# Altium project PCB_Project.PrjPcb
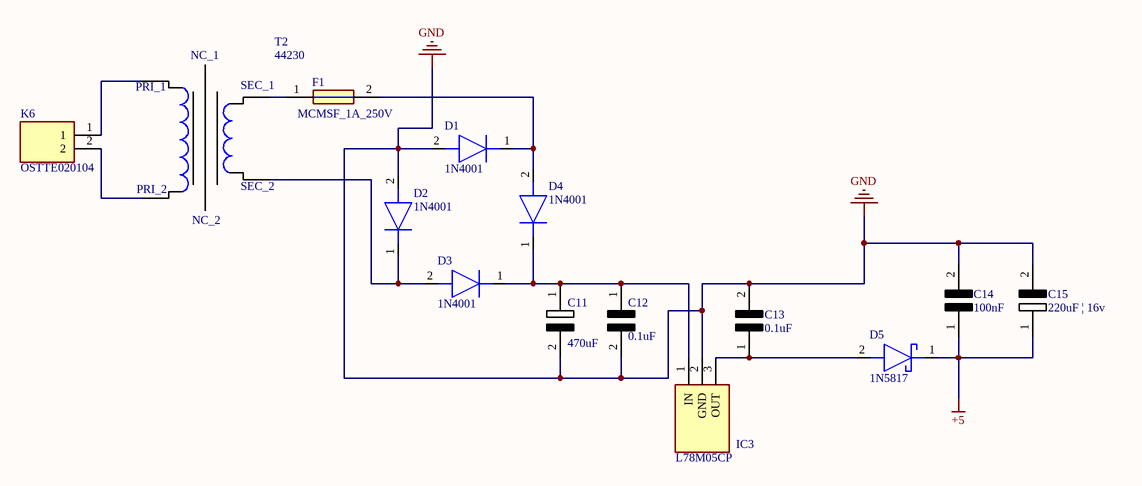
[diagram p0: Power_Unit.SchDoc]
4 sheets, 69 parts. Net scope: flat (ports and power ports of the same name join across sheets).
Board file: REDESIGN.PcbDoc
Sheets:
  Power_Unit.SchDoc
  Display_Unit.SchDoc
  Processing_Unit.SchDoc
  RTC_unit.SchDoc

## Sheet Power_Unit.SchDoc
size A4; SheetNumber: 1; SheetTotal: 4

### Parts
C11  470uF  [C0805]
C12  0.1uF  [C0805]
C13  0.1uF  [C0805]
C14  100nF  [C0805]
C15  220uF | 16v  [C0805]
D1  1N4001  [DIOAD1405W86L465D235]
D2  1N4001  [DIOAD1405W86L465D235]
D3  1N4001  [DIOAD1405W86L465D235]
D4  1N4001  [DIOAD1405W86L465D235]
D5  1N5817  [1n5817_footprint]
F1  MCMSF_1A_250V  [MCMSF1A250V]
IC3  L78M05CP  [TO255P460X1020X2030-3P]
K6  OSTTE020104  [OSTTE020104]
T2  44230  [44230]

### Nets
+5: C14.1 C15.1 D5.1(K)
GND: C11.2 C12.2 C13.2 C14.2 C15.2 D1.2(A) D2.2(A) IC3.2(GND)
NetC11_1: C11.1 C12.1 D3.1(K) D4.1(K) IC3.1(IN)
NetC13_1: C13.1 D5.2(A) IC3.3(OUT)
NetD1_1: D1.1(K) D4.2(A) F1.2
NetD2_1: D2.1(K) D3.2(A) T2.9(SEC_2)
NetF1_1: F1.1 T2.7(SEC_1)
NetK6_1: K6.1 T2.1(PRI_1)
NetK6_2: K6.2 T2.5(PRI_2)

Not connected (* = marked no-connect by the designer): T2 6(NC_1) 10(NC_2)

### Library data of the parts
C11 C15 = elektrolytischeC0805: 0805 ceramic capacitor; Manufacturer_Name: Murata Electronics; Manufacturer_Part_Number: GRM188R71H103KA01D; Datasheet Link: https://datasheet.datasheetarchive.com/originals/distributors/Datasheets_SAMA/ec4f1577dddcc7a13ddad897a28002d3.pdf; Height: 0.9mm; Mouser Part Number: 81-GRM39X103K50D; Mouser Price/Stock: https://www.mouser.co.uk/ProductDetail/Murata-Electronics/GRM188R71H103KA01D?qs=WWniysbtxULrL2ljbViAbw%3D%3D; Arrow Part Number: GRM188R71H103KA01D; Arrow Price/Stock: https://www.arrow.com/en/products/grm188r71h103ka01d/murata-manufacturing?region=europe
C12-C14 = KeramischeC0805_1: 0805 ceramic capacitor; Manufacturer_Name: Murata Electronics; Manufacturer_Part_Number: GRM188R71H103KA01D; Datasheet Link: https://datasheet.datasheetarchive.com/originals/distributors/Datasheets_SAMA/ec4f1577dddcc7a13ddad897a28002d3.pdf; Height: 0.9mm; Mouser Part Number: 81-GRM39X103K50D; Mouser Price/Stock: https://www.mouser.co.uk/ProductDetail/Murata-Electronics/GRM188R71H103KA01D?qs=WWniysbtxULrL2ljbViAbw%3D%3D; Arrow Part Number: GRM188R71H103KA01D; Arrow Price/Stock: https://www.arrow.com/en/products/grm188r71h103ka01d/murata-manufacturing?region=europe
D1-D4 = 1N4001: Diode; Manufacturer_Name: Vishay; Datasheet Link: https://www.vishay.com/docs/88503/1n4001.pdf; Manufacturer_Part_Number: 1N4001
D5 = 1N5817: Schottky Diode; Manufacturer_Name: Rectron; Datasheet Link: https://www.arrow.com/en/products/1n5817/rectron; Manufacturer_Part_Number: 1N5817; Arrow Part Number: 1N5817; Arrow Price/Stock: https://www.arrow.com/en/products/1n5817/rectron?region=nac
F1 = MCMSF_1A_250V: Fuse; Manufacturer_Name: Multicomp Pro; Manufacturer_Part_Number: MCMSF 1A 250V; Datasheet Link: https://componentsearchengine.com/Datasheets/2/MCMSF%201A%20250V.pdf; Height: 7.7mm
IC3 = L78M05CP: Integrated Circuit; Manufacturer_Name: STMicroelectronics; Datasheet Link: http://www.st.com/web/en/resource/technical/document/datasheet/CD00000447.pdf; Height: 4.6mm; Manufacturer_Part_Number: L78M05CP; Mouser Part Number: 511-L78M05CP; Mouser Price/Stock: https://www.mouser.co.uk/ProductDetail/STMicroelectronics/L78M05CP?qs=W%252B4obUA0F3anQylSbAkrfw%3D%3D; Arrow Part Number: L78M05CP; Arrow Price/Stock: https://www.arrow.com/en/products/l78m05cp/stmicroelectronics?region=europe
K6 = OSTTE020104: Connector; Manufacturer_Name: On Shore Technology Inc.; Datasheet Link: https://datasheet.datasheetarchive.com/originals/dk/DKDS-18/336634.pdf; Height: 8.7mm; Manufacturer_Part_Number: OSTTE020104
T2 = 44230: Transformer; Manufacturer_Name: MYRRA; Datasheet Link: https://componentsearchengine.com/Datasheets/2/44230.pdf; Height: 32.8mm; Manufacturer_Part_Number: 44230; Arrow Part Number: 44230; Arrow Price/Stock: https://www.arrow.com/en/products/44230/myrra?region=europe

## Sheet Display_Unit.SchDoc
size A4; SheetNumber: 2; SheetTotal: 4
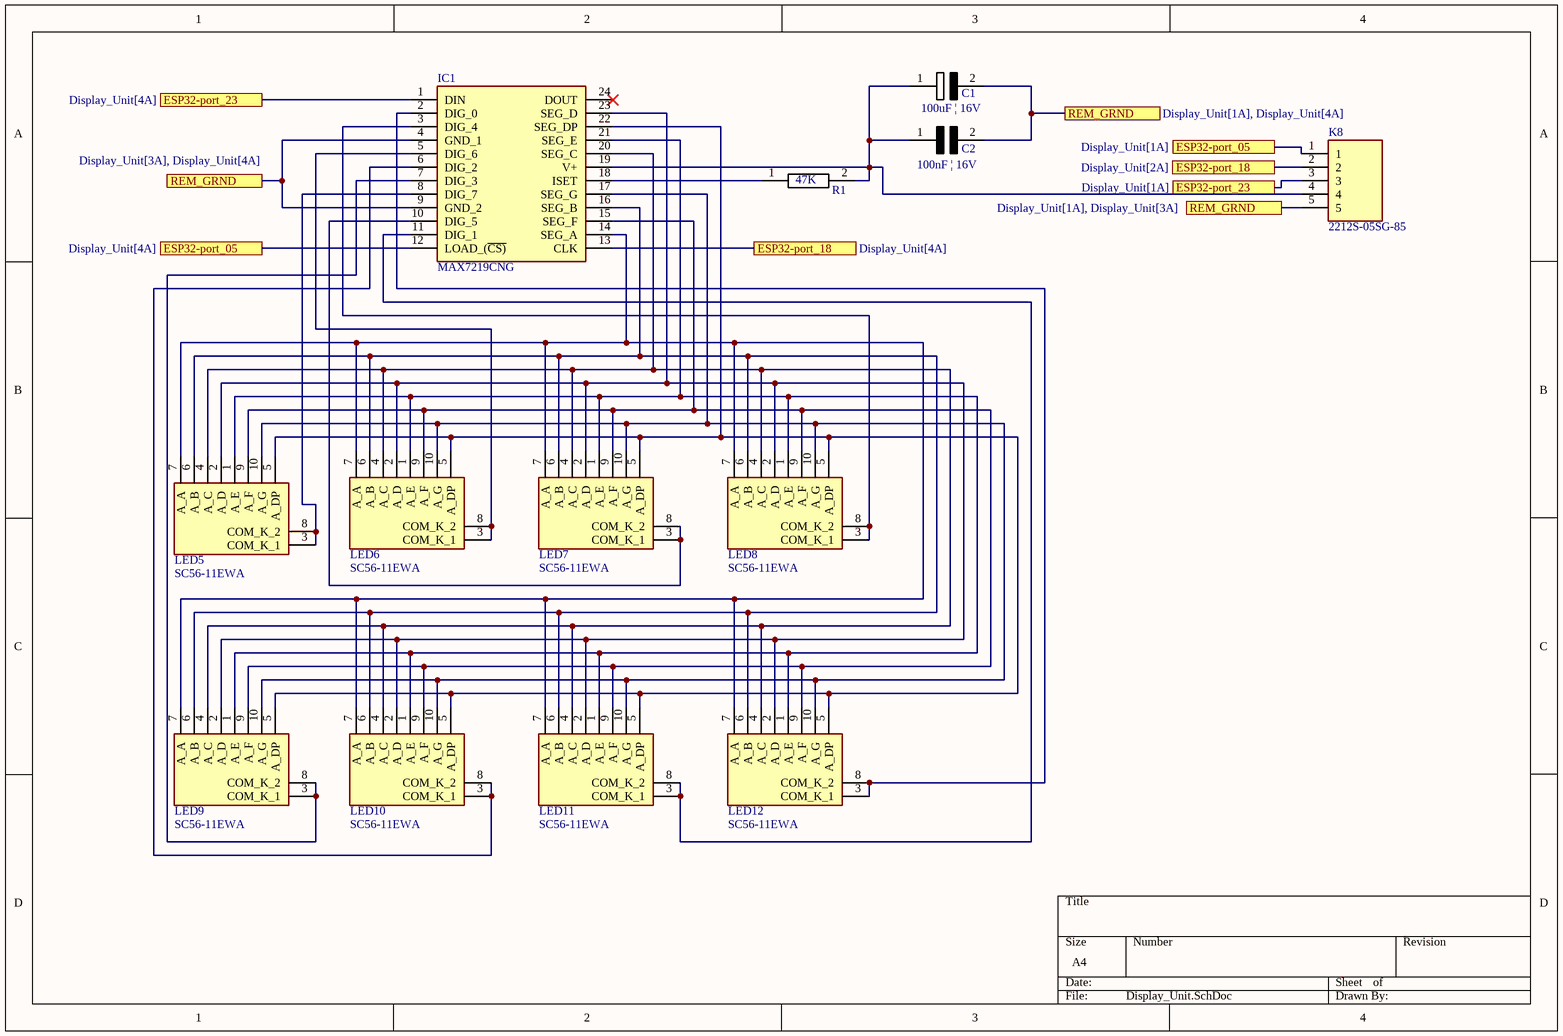
[diagram p1: Display_Unit.SchDoc]

### Parts
C1  100uF | 16V  [C0805]
C2  100nF | 16V  [C0805]
IC1  MAX7219CNG  [DIP794W56P254L3054H457Q24N]
K8  2212S-05SG-85  [RHDR5W74P0X254_1X5_1320X250X850P]
LED5  SC56-11EWA  [DIPS1524W75P254L1270H825Q10N]
LED6  SC56-11EWA  [DIPS1524W75P254L1270H825Q10N]
LED7  SC56-11EWA  [DIPS1524W75P254L1270H825Q10N]
LED8  SC56-11EWA  [DIPS1524W75P254L1270H825Q10N]
LED9  SC56-11EWA  [DIPS1524W75P254L1270H825Q10N]
LED10  SC56-11EWA  [DIPS1524W75P254L1270H825Q10N]
LED11  SC56-11EWA  [DIPS1524W75P254L1270H825Q10N]
LED12  SC56-11EWA  [DIPS1524W75P254L1270H825Q10N]
R1  47K  [C0805]

### Ports
ESP32-port_05 (see Display_Unit[1A]), ESP32-port_05 (see Display_Unit[4A]), ESP32-port_18 (see Display_Unit[2A]), ESP32-port_18 (see Display_Unit[4A]), ESP32-port_23 (see Display_Unit[1A]), ESP32-port_23 (see Display_Unit[4A]), REM_GRND (see Display_Unit[1A], Display_Unit[3A]), REM_GRND (see Display_Unit[1A], Display_Unit[4A]), REM_GRND (see Display_Unit[3A], Display_Unit[4A])

### Nets
NetC1_1: C1.1 C2.1 IC1.19(V+) K8.4 R1.2
NetC1_2: C1.2 C2.2 IC1.4(GND_1) IC1.9(GND_2) K8.5 ; port REM_GRND
NetIC1_1: IC1.1(DIN) K8.3 ; port ESP32-port_23
NetIC1_2: IC1.2(DIG_0) LED12.3(COM_K_1) LED12.8(COM_K_2)
NetIC1_3: IC1.3(DIG_4) LED8.3(COM_K_1) LED8.8(COM_K_2)
NetIC1_5: IC1.5(DIG_6) LED6.3(COM_K_1) LED6.8(COM_K_2)
NetIC1_6: IC1.6(DIG_2) LED10.3(COM_K_1) LED10.8(COM_K_2)
NetIC1_7: IC1.7(DIG_3) LED9.3(COM_K_1) LED9.8(COM_K_2)
NetIC1_8: IC1.8(DIG_7) LED5.3(COM_K_1) LED5.8(COM_K_2)
NetIC1_10: IC1.10(DIG_5) LED7.3(COM_K_1) LED7.8(COM_K_2)
NetIC1_11: IC1.11(DIG_1) LED11.3(COM_K_1) LED11.8(COM_K_2)
NetIC1_12: IC1.12(LOAD_(~{CS)}) K8.1 ; port ESP32-port_05
NetIC1_13: IC1.13(CLK) K8.2 ; port ESP32-port_18
NetIC1_14: IC1.14(SEG_A) LED5.7(A_A) LED6.7(A_A) LED7.7(A_A) LED8.7(A_A) LED9.7(A_A) LED10.7(A_A) LED11.7(A_A) LED12.7(A_A)
NetIC1_15: IC1.15(SEG_F) LED5.9(A_F) LED6.9(A_F) LED7.9(A_F) LED8.9(A_F) LED9.9(A_F) LED10.9(A_F) LED11.9(A_F) LED12.9(A_F)
NetIC1_16: IC1.16(SEG_B) LED5.6(A_B) LED6.6(A_B) LED7.6(A_B) LED8.6(A_B) LED9.6(A_B) LED10.6(A_B) LED11.6(A_B) LED12.6(A_B)
NetIC1_17: IC1.17(SEG_G) LED5.10(A_G) LED6.10(A_G) LED7.10(A_G) LED8.10(A_G) LED9.10(A_G) LED10.10(A_G) LED11.10(A_G) LED12.10(A_G)
NetIC1_18: IC1.18(ISET) R1.1
NetIC1_20: IC1.20(SEG_C) LED5.4(A_C) LED6.4(A_C) LED7.4(A_C) LED8.4(A_C) LED9.4(A_C) LED10.4(A_C) LED11.4(A_C) LED12.4(A_C)
NetIC1_21: IC1.21(SEG_E) LED5.1(A_E) LED6.1(A_E) LED7.1(A_E) LED8.1(A_E) LED9.1(A_E) LED10.1(A_E) LED11.1(A_E) LED12.1(A_E)
NetIC1_22: IC1.22(SEG_DP) LED5.5(A_DP) LED6.5(A_DP) LED7.5(A_DP) LED8.5(A_DP) LED9.5(A_DP) LED10.5(A_DP) LED11.5(A_DP) LED12.5(A_DP)
NetIC1_23: IC1.23(SEG_D) LED5.2(A_D) LED6.2(A_D) LED7.2(A_D) LED8.2(A_D) LED9.2(A_D) LED10.2(A_D) LED11.2(A_D) LED12.2(A_D)

Not connected (* = marked no-connect by the designer): IC1 24(DOUT)*

### Library data of the parts
C1 = elektrolytischeC0805: as C11 on sheet Power_Unit; Datasheet Link: https://datasheet.datasheetarchive.com/originals/distributors/Datasheets_SAMA/ec4f1577dddcc7a13ddad897a28002d3.pdf; Height: 0.9mm; Mouser Part Number: 81-GRM39X103K50D; Mouser Price/Stock: https://www.mouser.co.uk/ProductDetail/Murata-Electronics/GRM188R71H103KA01D?qs=WWniysbtxULrL2ljbViAbw%3D%3D; Arrow Part Number: GRM188R71H103KA01D; Arrow Price/Stock: https://www.arrow.com/en/products/grm188r71h103ka01d/murata-manufacturing?region=europe
C2 = KeramischeC0805_1: as C12 on sheet Power_Unit; Datasheet Link: https://datasheet.datasheetarchive.com/originals/distributors/Datasheets_SAMA/ec4f1577dddcc7a13ddad897a28002d3.pdf; Height: 0.9mm; Mouser Part Number: 81-GRM39X103K50D; Mouser Price/Stock: https://www.mouser.co.uk/ProductDetail/Murata-Electronics/GRM188R71H103KA01D?qs=WWniysbtxULrL2ljbViAbw%3D%3D; Arrow Part Number: GRM188R71H103KA01D; Arrow Price/Stock: https://www.arrow.com/en/products/grm188r71h103ka01d/murata-manufacturing?region=europe
IC1 = MAX7219CNG: Integrated Circuit; Manufacturer_Name: Analog Devices; Datasheet Link: https://datasheets.maximintegrated.com/en/ds/MAX7219-MAX7221.pdf; Height: 4.572mm; Manufacturer_Part_Number: MAX7219CNG; Mouser Part Number: 700-MAX7219CNG-NR; Mouser Price/Stock: https://www.mouser.co.uk/ProductDetail/Maxim-Integrated/MAX7219CNG?qs=p6VZ%252BklCkRToQRlZGegBBA%3D%3D
K8 = 2212S-05SG-85: Connector; Manufacturer_Name: Multicomp Pro; Datasheet Link: https://componentsearchengine.com/Datasheets/2/2212S-05SG-85.pdf; Height: 8.5mm; Manufacturer_Part_Number: 2212S-05SG-85
LED5-LED12 = SC56-11EWA: Display; Manufacturer_Name: Kingbright; Datasheet Link: https://www.kingbrightusa.com/images/catalog/SPEC/SC56-11EWA.pdf; Height: 8.25mm; Manufacturer_Part_Number: SC56-11EWA; Mouser Part Number: 604-SC56-11EWA; Mouser Price/Stock: https://www.mouser.co.uk/ProductDetail/Kingbright/SC56-11EWA?qs=y3UkhjaxUTZA9319us7IBQ%3D%3D
R1 = Resistor0805: Manufacturer_Name: Vishay; Manufacturer_Part_Number: CRCW08050000Z0EAHP; Datasheet Link: https://componentsearchengine.com/Datasheets/1/CRCW08051R00FKEAHP.pdf; Height: 0.6mm; Mouser Part Number: 71-CRCW08050000Z0EAH; Mouser Price/Stock: https://www.mouser.co.uk/ProductDetail/Vishay-Dale/CRCW08050000Z0EAHP?qs=pTGEtN%252BMLlDLrJUqQmN2jA%3D%3D; Arrow Part Number: CRCW08050000Z0EAHP; Arrow Price/Stock: https://www.arrow.com/en/products/crcw08050000z0eahp/vishay?region=nac

## Sheet Processing_Unit.SchDoc
size A4; SheetNumber: 3; SheetTotal: 4
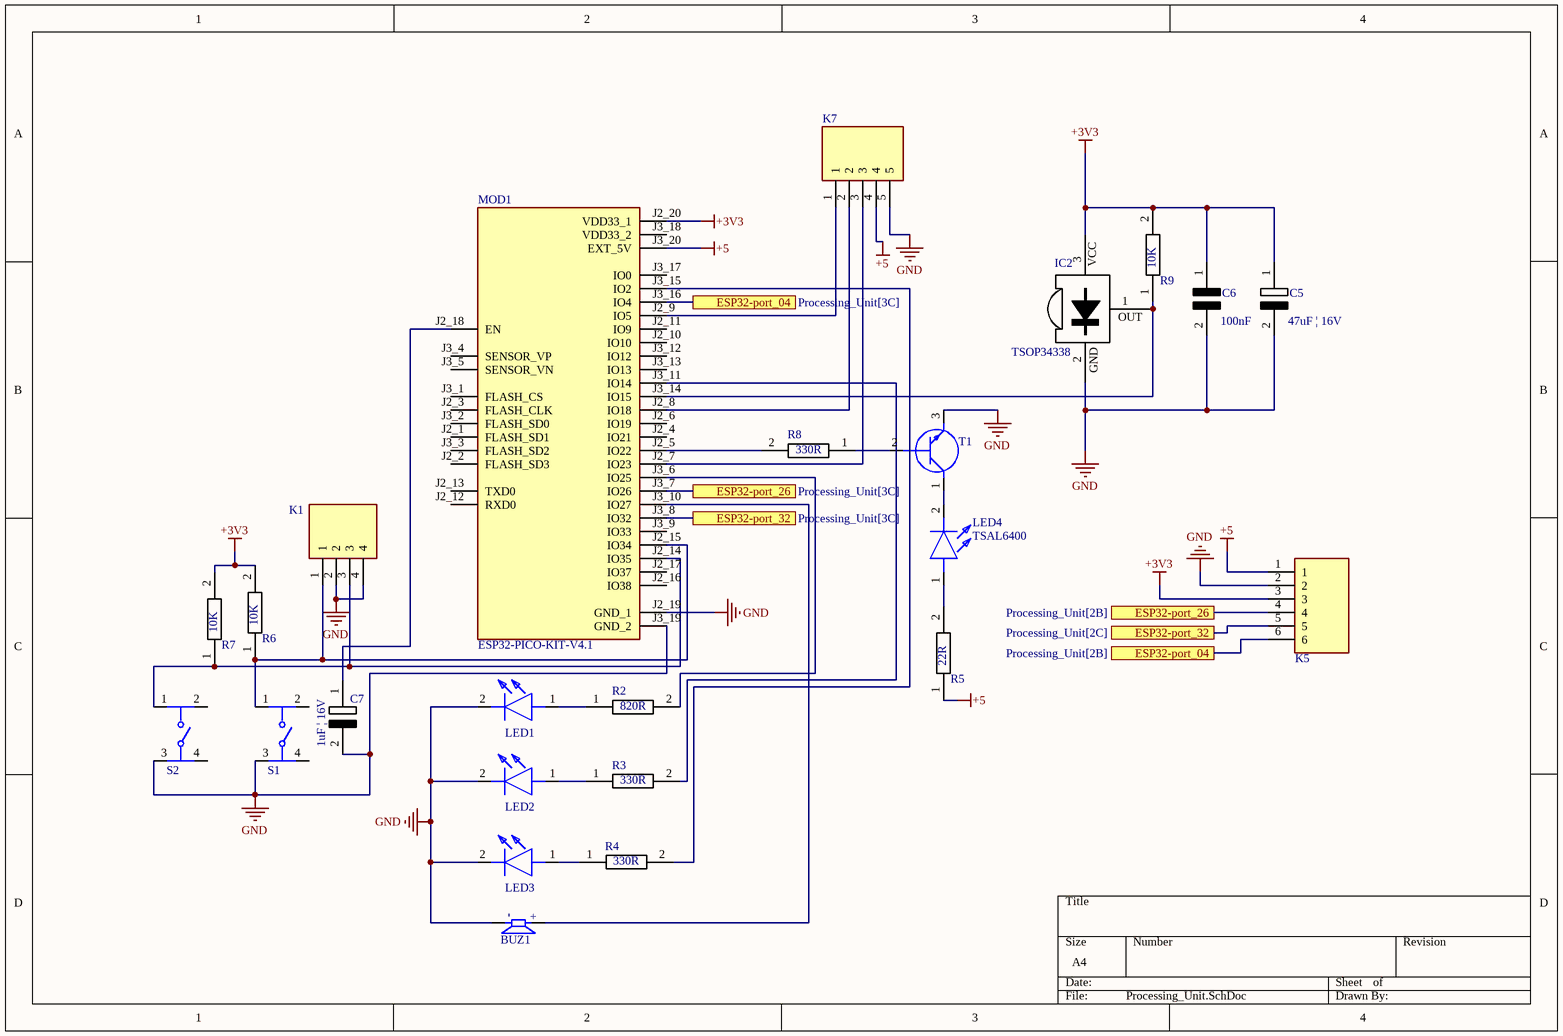
[diagram p2: Processing_Unit.SchDoc]

### Parts
BUZ1  CEM-1212S  [CUI_CEM-1212S]  (value not drawn)
C5  47uF | 16V  [C0805]
C6  100nF  [C0805]
C7  1uF | 16V  [C0805]
IC2  TSOP34338  [TO_TSOP31236]
K1  2212S-04SG-85  [2212S04SG85]  (value not drawn)
K5  2212S-06SG-85  [RHDR6W74P0X254_1X6_1574X250X850P]  (value not drawn)
K7  2212S-05SG-85  [RHDR5W74P0X254_1X5_1320X250X850P]  (value not drawn)
LED1  TLHO4200  [TLHO4200]  (value not drawn)
LED2  TLHO4200  [TLHO4200]  (value not drawn)
LED3  TLHO4200  [TLHO4200]  (value not drawn)
LED4  TSAL6400  [TSAL6400]
MOD1  ESP32-PICO-KIT-V4.1  [XCVR_ESP32-PICO-KIT-V4.1]
R2  820R  [C0805]
R3  330R  [C0805]
R4  330R  [C0805]
R5  22R  [C0805]
R6  10K  [C0805]
R7  10K  [C0805]
R8  330R  [C0805]
R9  10K  [C0805]
S1  FSM103  [FP-FSM103-MFG]  (value not drawn)
S2  FSM103  [FP-FSM103-MFG]  (value not drawn)
T1  BC33716TA  [BC33716TA]  (value not drawn)

### Ports
ESP32-port_04 (see Processing_Unit[2B]), ESP32-port_04 (see Processing_Unit[3C]), ESP32-port_26 (see Processing_Unit[2B]), ESP32-port_26 (see Processing_Unit[3C]), ESP32-port_32 (see Processing_Unit[2C]), ESP32-port_32 (see Processing_Unit[3C])

### Nets
+3V3: C5.1 C6.1 IC2.3(VS) K5.3 MOD1.J2_20(VDD33_1) R6.2 R7.2 R9.2
+5: K5.1 K7.4 MOD1.J3_20(EXT_5V) R5.1
GND: BUZ1.M C5.2 C6.2 C7.2 IC2.2(GND) K1.2 K1.4 K5.2 K7.5 LED1.2(K) LED2.2(K) LED3.2(K) MOD1.J2_19(GND_1) MOD1.J3_19(GND_2) S1.3 S2.3 T1.3(E)
NetBUZ1_P: BUZ1.P MOD1.J3_10(IO27)
NetC7_1: C7.1 MOD1.J2_18(EN)
NetIC2_1: IC2.1(OUT) MOD1.J3_14(IO15) R9.1
NetK1_1: K1.1 MOD1.J2_15(IO34) R6.1 S1.1
NetK1_3: K1.3 MOD1.J2_14(IO35) R7.1 S2.1
NetK5_4: K5.4 MOD1.J3_7(IO26) ; port ESP32-port_26
NetK5_5: K5.5 MOD1.J3_8(IO32) ; port ESP32-port_32
NetK5_6: K5.6 MOD1.J3_16(IO4) ; port ESP32-port_04
NetK7_1: K7.1 MOD1.J2_9(IO5)
NetK7_2: K7.2 MOD1.J2_8(IO18)
NetK7_3: K7.3 MOD1.J2_7(IO23)
NetLED1_1: LED1.1(A) R2.1
NetLED2_1: LED2.1(A) R3.1
NetLED3_1: LED3.1(A) R4.1
NetLED4_1: LED4.1(A) R5.2
NetLED4_2: LED4.2(K) T1.1(C)
NetMOD1_J2_5: MOD1.J2_5(IO22) R8.2
NetMOD1_J3_6: MOD1.J3_6(IO25) R2.2
NetMOD1_J3_11: MOD1.J3_11(IO14) R3.2
NetMOD1_J3_15: MOD1.J3_15(IO2) R4.2
NetR8_1: R8.1 T1.2(B)

Not connected (* = marked no-connect by the designer): MOD1 J2_1(FLASH_SD1) J2_2(FLASH_SD3) J2_3(FLASH_CLK) J2_4(IO21) J2_6(IO19) J2_10(IO10) J2_11(IO9) J2_12(RXD0) J2_13(TXD0) J2_16(IO38) J2_17(IO37) J3_1(FLASH_CS) J3_2(FLASH_SD0) J3_3(FLASH_SD2) J3_4(SENSOR_VP) J3_5(SENSOR_VN) J3_9(IO33) J3_12(IO12) J3_13(IO13) J3_17(IO0) J3_18(VDD33_2); S1 2 4; S2 2 4

### Notes on the sheet
- (in symbol CEM-1212S) -; +
- (in symbol TSOP34338) VCC

### Library data of the parts
BUZ1 = CEM-1212S: 12 mm, 12 V, 85 dB, Through Hole, Sealed, Magnetic Audio Transducer Buzzer; MF: CUI Devices; Arrow_Electronics-Purchase-URL: https://snapeda.com/shop?store=Arrow+Electronics&id=601563; Value: *; SnapEDA_Link: https://www.snapeda.com/parts/CEM-1212S/CUI%20Devices/view-part/601563/?ref=snap; CUI_purchase_URL: https://www.cuidevices.com/product/audio/buzzers/audio-transducers/cem-1212s?utm_source=snapeda.com&utm_medium=referral&utm_campaign=snapedaBOM; MP: CEM-1212S; Availability: Good; Mouser-Purchase-URL: https://snapeda.com/shop?store=Mouser&id=601563; Price: None; DigiKey-Purchase-URL: https://snapeda.com/shop?store=DigiKey&id=601563; Package: TO-220 CUI Inc.
C5 C7 = elektrolytischeC0805: as C11 on sheet Power_Unit; Datasheet Link: https://datasheet.datasheetarchive.com/originals/distributors/Datasheets_SAMA/ec4f1577dddcc7a13ddad897a28002d3.pdf; Height: 0.9mm; Mouser Part Number: 81-GRM39X103K50D; Mouser Price/Stock: https://www.mouser.co.uk/ProductDetail/Murata-Electronics/GRM188R71H103KA01D?qs=WWniysbtxULrL2ljbViAbw%3D%3D; Arrow Part Number: GRM188R71H103KA01D; Arrow Price/Stock: https://www.arrow.com/en/products/grm188r71h103ka01d/murata-manufacturing?region=europe
C6 = KeramischeC0805_1: as C12 on sheet Power_Unit; Datasheet Link: https://datasheet.datasheetarchive.com/originals/distributors/Datasheets_SAMA/ec4f1577dddcc7a13ddad897a28002d3.pdf; Height: 0.9mm; Mouser Part Number: 81-GRM39X103K50D; Mouser Price/Stock: https://www.mouser.co.uk/ProductDetail/Murata-Electronics/GRM188R71H103KA01D?qs=WWniysbtxULrL2ljbViAbw%3D%3D; Arrow Part Number: GRM188R71H103KA01D; Arrow Price/Stock: https://www.arrow.com/en/products/grm188r71h103ka01d/murata-manufacturing?region=europe
IC2 = TSOP34338: No Description Available; Mfr_Name: Vishay; Type: Type; RefDes: RefDes
K1 = 2212S-04SG-85: Connector; Manufacturer_Name: Multicomp Pro; Datasheet Link: https://componentsearchengine.com/Datasheets/5/2212S-04SG-85.pdf; Height: 8.7mm; Manufacturer_Part_Number: 2212S-04SG-85
K5 = 2212S-06SG-85: Connector; Manufacturer_Name: Multicomp Pro; Datasheet Link: http://www.farnell.com/datasheets/2290158.pdf?_ga=2.3406896.1671530057.1506933545-2008293027.1497013038; Height: 8.5mm; Manufacturer_Part_Number: 2212S-06SG-85
K7 = 2212S-05SG-85: as K8 on sheet Display_Unit; Datasheet Link: https://componentsearchengine.com/Datasheets/2/2212S-05SG-85.pdf; Height: 8.5mm; Manufacturer_Part_Number: 2212S-05SG-85
LED1-LED3 = TLHO4200: LED; Manufacturer_Name: Vishay; Datasheet Link: https://www.mouser.com/datasheet/2/427/tlhg420-1767350.pdf; Height: 6.1mm; Manufacturer_Part_Number: TLHO4200
LED4 = TSAL6400: LED; Manufacturer_Name: Vishay; Datasheet Link: https://componentsearchengine.com/Datasheets/1/TSAL6400.pdf; Height: 9.7mm; Manufacturer_Part_Number: TSAL6400; Mouser Part Number: 782-TSAL6400; Mouser Price/Stock: https://www.mouser.co.uk/ProductDetail/Vishay-Semiconductors/TSAL6400?qs=oSAwVt7aKTHCOCv1ythi7g%3D%3D; Arrow Part Number: TSAL6400; Arrow Price/Stock: https://www.arrow.com/en/products/tsal6400/vishay?region=nac
MOD1 = ESP32-PICO-KIT-V4.1: WiFi Development Tools (802.11); MF: Espressif Systems; Price: None; Value: *; MP: ESP32-PICO-KIT-V4.1; Package: None; SnapEDA_Link: https://www.snapeda.com/parts/ESP32-PICO-KIT-V4.1/Espressif%20Systems/view-part/3211113/?ref=snap; Check_prices: https://www.snapeda.com/parts/ESP32-PICO-KIT-V4.1/Espressif%20Systems/view-part/3211113/?ref=eda; Availability: Bad
R2-R9 = Resistor0805: as R1 on sheet Display_Unit; Datasheet Link: https://componentsearchengine.com/Datasheets/1/CRCW08051R00FKEAHP.pdf; Height: 0.6mm; Mouser Part Number: 71-CRCW08050000Z0EAH; Mouser Price/Stock: https://www.mouser.co.uk/ProductDetail/Vishay-Dale/CRCW08050000Z0EAHP?qs=pTGEtN%252BMLlDLrJUqQmN2jA%3D%3D; Arrow Part Number: CRCW08050000Z0EAHP; Arrow Price/Stock: https://www.arrow.com/en/products/crcw08050000z0eahp/vishay?region=nac
S1 S2 = CMP-03407-000037-1: SWITCH TACTILE SPST-NO 0.05A 24V; Contact Resistance: 100mR; Actuator Length: 3.4mm; Switch Function: Off-Mom; Operating Force: 1.57N; Illumination Type: Non-Illuminated; Voltage Rating (DC): 12V; Current Rating: 50mA; Actuator Material: Polyester; Switch Travel: 0.3mm; Throw Configuration: SPST; Actuator Color: Black; Mechanical Life: 100000Cycles; Depth: 14.1mm; RoHS Compliant: Yes; Max Operating Temperature: 85°C; Mount: Through Hole; Min Operating Temperature: -35°C; Contact Plating: Silver; Width: 12mm; Package Quantity: 400; Radiation Hardening: No; Series: FSM100 ~ 104; Type: Switch; Termination: PC Pins; Voltage Rating: 24V; Contact Material: Brass; Max Voltage Rating (DC): 12V; Contact Current Rating: 50mA; Length: 12mm; Packaging: Loose Piece; Orientation: Straight; Max Current Rating: 50mA; Electrical Life: 100000Cycles
T1 = BC33716TA: Transistor BJT NPN; Manufacturer_Name: onsemi; Datasheet Link: https://rocelec.widen.net/view/pdf/hcqqbqwrik/ONSM-S-A0003590550-1.pdf?t.download=true&u=5oefqw; Height: 8.77mm; Manufacturer_Part_Number: BC33716TA; Mouser Part Number: 512-BC33716TA; Mouser Price/Stock: https://www.mouser.co.uk/ProductDetail/onsemi-Fairchild/BC33716TA?qs=UMEuL5FsraA5fR076NzQDQ%3D%3D; Arrow Part Number: BC33716TA; Arrow Price/Stock: https://www.arrow.com/en/products/bc33716ta/on-semiconductor?region=nac

## Sheet RTC_unit.SchDoc
size A4; SheetNumber: 4; SheetTotal: 4
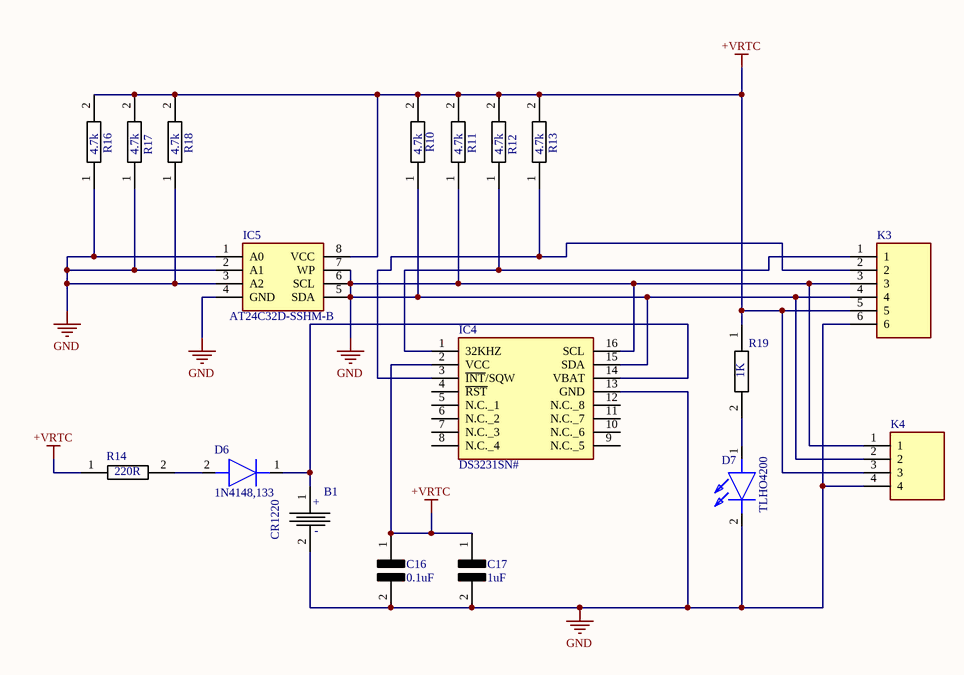
[diagram p3: RTC_unit.SchDoc]

### Parts
B1  CR1220  [CR1220HSMD]
C16  0.1uF  [C0805]
C17  1uF  [C0805]
D6  1N4148,133  [DIOAD1165W56L425D185]
D7  TLHO4200  [TLHO4200]
IC4  DS3231SN#  [SOIC127P1032X265-16N]
IC5  AT24C32D-SSHM-B  [SOIC127P600X175-8N]
K3  2212S-06SG-85  [RHDR6W74P0X254_1X6_1574X250X850P]  (value not drawn)
K4  2212S-04SG-85  [2212S04SG85]  (value not drawn)
R10  4.7k  [C0805]
R11  4.7k  [C0805]
R12  4.7k  [C0805]
R13  4.7k  [C0805]
R14  220R  [C0805]
R16  4.7k  [C0805]
R17  4.7k  [C0805]
R18  4.7k  [C0805]
R19  1K  [C0805]

### Nets
+VRTC: C16.1 C17.1 IC4.2(VCC) IC5.8(VCC) K3.5 K4.3 R10.2 R11.2 R12.2 R13.2 R14.1 R16.2 R17.2 R18.2 R19.1
GND: B1.2 C16.2 C17.2 D7.2(K) IC4.13(GND) IC4.15(SDA) IC4.16(SCL) IC5.1(A0) IC5.2(A1) IC5.3(A2) IC5.4(GND) IC5.5(SDA) IC5.6(SCL) IC5.7(WP) K3.3 K3.4 K3.6 K4.1 K4.2 K4.4 R10.1 R11.1 R16.1 R17.1 R18.1
NetB1_1: B1.1 D6.1(K) IC4.14(VBAT)
NetD6_2: D6.2(A) R14.2
NetD7_1: D7.1(A) R19.2
NetIC4_1: IC4.1(32KHZ) K3.1 R12.1
NetIC4_3: IC4.3(~{INT}/SQW) K3.2 R13.1

Not connected (* = marked no-connect by the designer): IC4 4(~{RST}) 5(N.C._1) 6(N.C._2) 7(N.C._3) 8(N.C._4) 9(N.C._5) 10(N.C._6) 11(N.C._7) 12(N.C._8)

### Notes on the sheet
- (in symbol CR1220-H-SMD) +; -

### Library data of the parts
B1 = CR1220-H-SMD: Integrated Circuit; Manufacturer_Name: ROBOTIS; Datasheet Link: https://www.robotics.org.za/CR1220-H-SMD; Height: 4.1mm; Manufacturer_Part_Number: CR1220-H-SMD
C16 C17 = KeramischeC0805_1: as C12 on sheet Power_Unit; Datasheet Link: https://datasheet.datasheetarchive.com/originals/distributors/Datasheets_SAMA/ec4f1577dddcc7a13ddad897a28002d3.pdf; Height: 0.9mm; Mouser Part Number: 81-GRM39X103K50D; Mouser Price/Stock: https://www.mouser.co.uk/ProductDetail/Murata-Electronics/GRM188R71H103KA01D?qs=WWniysbtxULrL2ljbViAbw%3D%3D; Arrow Part Number: GRM188R71H103KA01D; Arrow Price/Stock: https://www.arrow.com/en/products/grm188r71h103ka01d/murata-manufacturing?region=europe
D6 = 1N4148,133: Diode; Manufacturer_Name: Nexperia; Datasheet Link: https://assets.nexperia.com/documents/data-sheet/1N4148_1N4448.pdf; Manufacturer_Part_Number: 1N4148,133; Mouser Part Number: 771-1N4148,133; Mouser Price/Stock: https://www.mouser.co.uk/ProductDetail/Nexperia/1N4148133?qs=elmhQ6eFu7hy8ApvpFxPZg%3D%3D; Arrow Part Number: 1N4148,133; Arrow Price/Stock: https://www.arrow.com/en/products/1n4148133/nxp-semiconductors
D7 = TLHO4200: LED; Manufacturer_Name: Vishay; Datasheet Link: https://www.mouser.com/datasheet/2/427/tlhg420-1767350.pdf; Height: 6.1mm; Manufacturer_Part_Number: TLHO4200
IC4 = DS3231SN#: Integrated Circuit; Manufacturer_Name: Analog Devices; Datasheet Link: https://datasheets.maximintegrated.com/en/ds/DS3231.pdf; Height: 2.65mm; Manufacturer_Part_Number: DS3231SN#; Mouser Part Number: 700-DS3231SN#; Mouser Price/Stock: https://www.mouser.co.uk/ProductDetail/Analog-Devices-Maxim-Integrated/DS3231SN?qs=1eQvB6Dk1vhUlr8%2FOrV0Fw%3D%3D; Arrow Part Number: DS3231SN#; Arrow Price/Stock: https://www.arrow.com/en/products/ds3231sn/analog-devices?region=europe
IC5 = AT24C32D-SSHM-B: Integrated Circuit; Manufacturer_Name: Microchip; Datasheet Link: http://www.atmel.com/images/atmel-8866-seeprom-at24c32d-datasheet.pdf; Height: 1.75mm; Manufacturer_Part_Number: AT24C32D-SSHM-B; Mouser Part Number: 556-AT24C32D-SSHM-B; Mouser Price/Stock: https://www.mouser.co.uk/ProductDetail/Microchip-Technology/AT24C32D-SSHM-B?qs=ZZMt4ii29sN2mTRLl%2FnVJA%3D%3D; Arrow Part Number: AT24C32D-SSHM-B; Arrow Price/Stock: https://www.arrow.com/en/products/at24c32d-sshm-b/microchip-technology?region=europe
K3 = 2212S-06SG-85: as K5 on sheet Processing_Unit; Datasheet Link: http://www.farnell.com/datasheets/2290158.pdf?_ga=2.3406896.1671530057.1506933545-2008293027.1497013038; Height: 8.5mm; Manufacturer_Part_Number: 2212S-06SG-85
K4 = 2212S-04SG-85: as K1 on sheet Processing_Unit; Datasheet Link: https://componentsearchengine.com/Datasheets/5/2212S-04SG-85.pdf; Height: 8.7mm; Manufacturer_Part_Number: 2212S-04SG-85
R10-R14 R16-R19 = Resistor0805: as R1 on sheet Display_Unit; Datasheet Link: https://componentsearchengine.com/Datasheets/1/CRCW08051R00FKEAHP.pdf; Height: 0.6mm; Mouser Part Number: 71-CRCW08050000Z0EAH; Mouser Price/Stock: https://www.mouser.co.uk/ProductDetail/Vishay-Dale/CRCW08050000Z0EAHP?qs=pTGEtN%252BMLlDLrJUqQmN2jA%3D%3D; Arrow Part Number: CRCW08050000Z0EAHP; Arrow Price/Stock: https://www.arrow.com/en/products/crcw08050000z0eahp/vishay?region=nac

## Nets that join several sheets
+5: Power_Unit (C14.1 C15.1 D5.1), Processing_Unit (K5.1 K7.4 MOD1.J3_20 R5.1)
GND: Power_Unit (8 pins), Processing_Unit (17 pins), RTC_unit (25 pins)